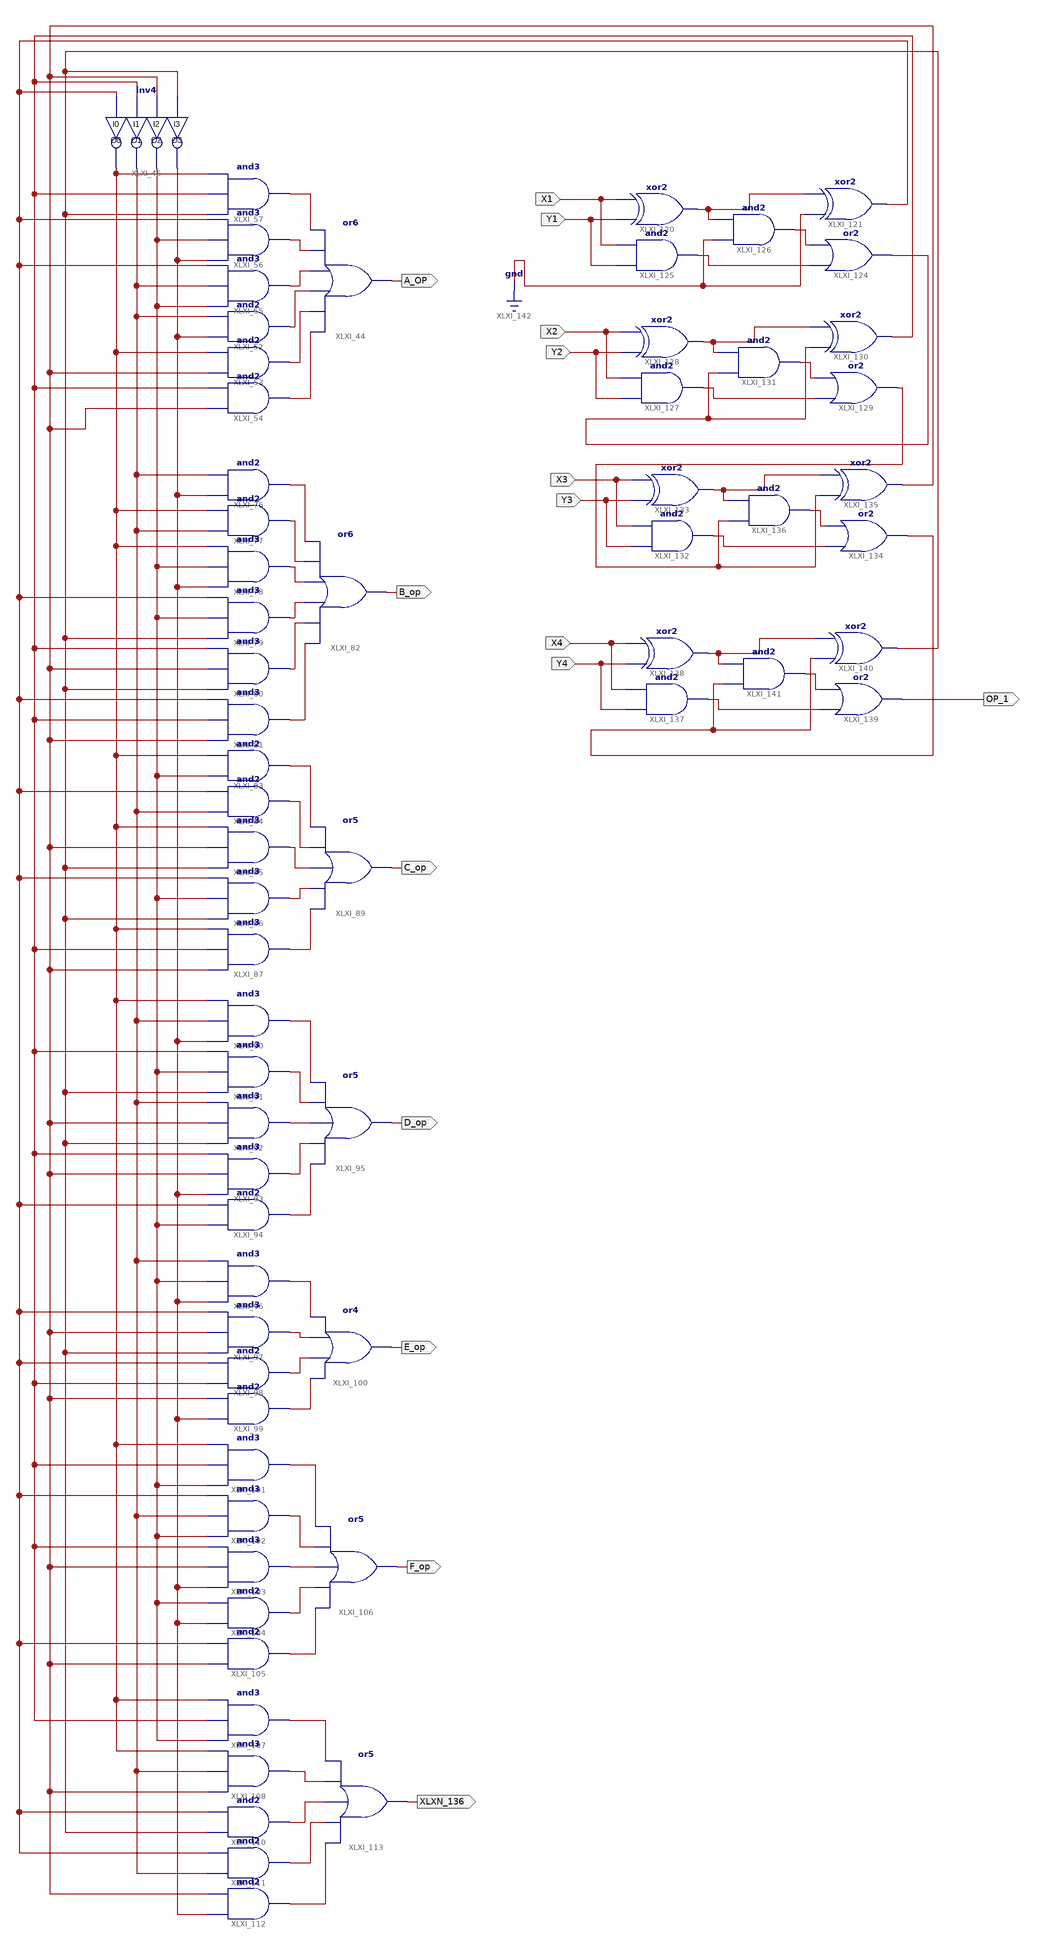
[diagram p0: schematic sheet 1]
// Xilinx ISE schematic lab6.sch (spartan6) as structural Verilog: 64 symbols, 16 ports
module lab6 (
  input  X1,
  input  Y1,
  input  X2,
  input  Y2,
  input  X3,
  input  Y3,
  input  X4,
  input  Y4,
  output A_OP,
  output B_op,
  output C_op,
  output D_op,
  output E_op,
  output F_op,
  output XLXN_136,
  output OP_1
);

  wire A, B, C, D, XLXN_80, XLXN_84, XLXN_86, XLXN_87, XLXN_88, XLXN_89, XLXN_90, XLXN_91, XLXN_92, XLXN_93,
       XLXN_97, XLXN_98, XLXN_99, XLXN_100, XLXN_101, XLXN_102, XLXN_107, XLXN_108, XLXN_109, XLXN_110,
       XLXN_111, XLXN_112, XLXN_113, XLXN_114, XLXN_115, XLXN_116, XLXN_117, XLXN_119, XLXN_120, XLXN_121,
       XLXN_122, XLXN_123, XLXN_124, XLXN_125, XLXN_126, XLXN_127, XLXN_128, XLXN_129, XLXN_130, XLXN_131,
       XLXN_146, XLXN_150, XLXN_151, XLXN_152, XLXN_154, XLXN_156, XLXN_157, XLXN_160, XLXN_162, XLXN_163,
       XLXN_164, XLXN_166, XLXN_168, XLXN_169, XLXN_174;

  or XLXI_44 (A_OP, XLXN_88, XLXN_89, XLXN_90, XLXN_91, XLXN_92, XLXN_93);
  inv4 XLXI_45 (.I0(A), .I1(B), .I2(C), .I3(D), .O0(XLXN_87), .O1(XLXN_86), .O2(XLXN_84), .O3(XLXN_80));
  and XLXI_52 (XLXN_90, XLXN_80, XLXN_86);
  and XLXI_53 (XLXN_89, C, XLXN_87);
  and XLXI_54 (XLXN_88, C, B);
  and XLXI_55 (XLXN_91, XLXN_84, XLXN_86, A);
  and XLXI_56 (XLXN_92, XLXN_80, XLXN_84, A);
  and XLXI_57 (XLXN_93, D, B, XLXN_87);
  and XLXI_76 (XLXN_97, XLXN_80, XLXN_86);
  and XLXI_77 (XLXN_98, XLXN_86, XLXN_87);
  and XLXI_78 (XLXN_99, XLXN_80, XLXN_84, XLXN_87);
  and XLXI_79 (XLXN_100, D, XLXN_84, A);
  and XLXI_80 (XLXN_101, D, C, B);
  and XLXI_81 (XLXN_102, C, B, A);
  or XLXI_82 (B_op, XLXN_102, XLXN_101, XLXN_100, XLXN_99, XLXN_98, XLXN_97);
  and XLXI_83 (XLXN_107, XLXN_84, XLXN_87);
  and XLXI_84 (XLXN_108, XLXN_86, A);
  and XLXI_85 (XLXN_109, D, C, XLXN_87);
  and XLXI_86 (XLXN_110, D, XLXN_84, A);
  and XLXI_87 (XLXN_111, C, B, XLXN_87);
  or XLXI_89 (C_op, XLXN_111, XLXN_110, XLXN_109, XLXN_108, XLXN_107);
  and XLXI_90 (XLXN_112, XLXN_80, XLXN_86, XLXN_87);
  and XLXI_91 (XLXN_113, D, XLXN_84, B);
  and XLXI_92 (XLXN_114, D, C, XLXN_86);
  and XLXI_93 (XLXN_115, XLXN_80, C, B);
  and XLXI_94 (XLXN_116, XLXN_84, A);
  or XLXI_95 (D_op, XLXN_116, XLXN_115, XLXN_114, XLXN_113, XLXN_112);
  and XLXI_96 (XLXN_117, XLXN_80, XLXN_84, XLXN_86);
  and XLXI_97 (XLXN_119, D, C, A);
  and XLXI_98 (XLXN_120, B, A);
  and XLXI_99 (XLXN_121, XLXN_80, C);
  or XLXI_100 (E_op, XLXN_121, XLXN_120, XLXN_119, XLXN_117);
  and XLXI_101 (XLXN_122, XLXN_84, B, XLXN_87);
  and XLXI_102 (XLXN_123, XLXN_84, XLXN_86, A);
  and XLXI_103 (XLXN_124, XLXN_80, C, B);
  and XLXI_104 (XLXN_125, XLXN_80, XLXN_84);
  and XLXI_105 (XLXN_126, C, A);
  or XLXI_106 (F_op, XLXN_126, XLXN_125, XLXN_124, XLXN_123, XLXN_122);
  and XLXI_107 (XLXN_127, XLXN_84, B, XLXN_87);
  and XLXI_108 (XLXN_128, C, XLXN_86, XLXN_87);
  and XLXI_110 (XLXN_129, D, A);
  and XLXI_111 (XLXN_130, XLXN_86, A);
  and XLXI_112 (XLXN_131, XLXN_80, C);
  or XLXI_113 (XLXN_136, XLXN_131, XLXN_130, XLXN_129, XLXN_128, XLXN_127);
  xor XLXI_120 (XLXN_146, Y1, X1);
  xor XLXI_121 (A, 1'b0, XLXN_146);
  or XLXI_124 (XLXN_152, XLXN_150, XLXN_151);
  and XLXI_125 (XLXN_150, Y1, X1);
  and XLXI_126 (XLXN_151, 1'b0, XLXN_146);
  and XLXI_127 (XLXN_156, Y2, X2);
  xor XLXI_128 (XLXN_154, Y2, X2);
  or XLXI_129 (XLXN_174, XLXN_156, XLXN_157);
  xor XLXI_130 (B, XLXN_152, XLXN_154);
  and XLXI_131 (XLXN_157, XLXN_152, XLXN_154);
  and XLXI_132 (XLXN_162, Y3, X3);
  xor XLXI_133 (XLXN_160, Y3, X3);
  or XLXI_134 (XLXN_164, XLXN_162, XLXN_163);
  xor XLXI_135 (C, XLXN_174, XLXN_160);
  and XLXI_136 (XLXN_163, XLXN_174, XLXN_160);
  and XLXI_137 (XLXN_168, Y4, X4);
  xor XLXI_138 (XLXN_166, Y4, X4);
  or XLXI_139 (OP_1, XLXN_168, XLXN_169);
  xor XLXI_140 (D, XLXN_164, XLXN_166);
  and XLXI_141 (XLXN_169, XLXN_164, XLXN_166);
endmodule
